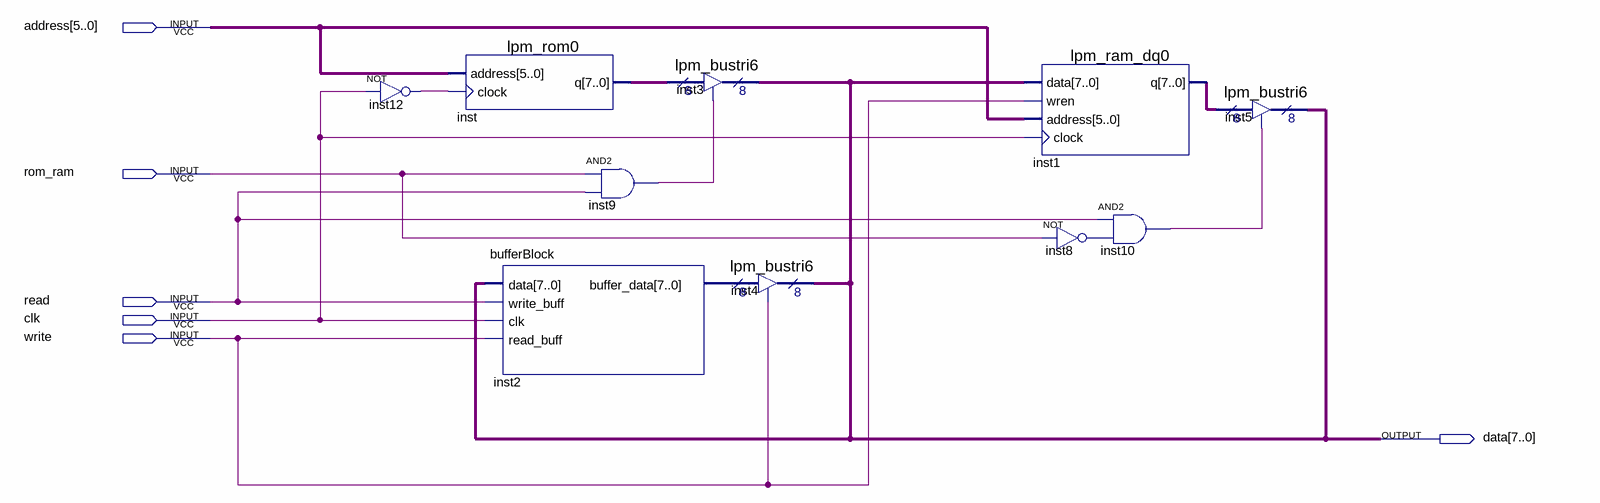
[diagram p0: schematic sheet]
// Quartus schematic mainBlock.bdf as structural Verilog: 10 symbols, 6 pins
module mainBlock (
  input  [5:0] address,
  input  rom_ram,
  input  read,
  input  clk,
  input  write,
  output [7:0] data
);

  wire inst8_out, inst9_out, inst10_out, inst12_out;
  wire [7:0] inst1_q, inst2_buffer_data, inst_q;

  not inst12 (inst12_out, clk);
  lpm_rom0 inst (.address(address), .clock(inst12_out), .q(inst_q));
  bufferBlock inst2 (.data(data), .write_buff(read), .clk(clk), .read_buff(write), .buffer_data(inst2_buffer_data));
  and inst9 (inst9_out, rom_ram, read);
  lpm_bustri6 inst3 (.enabledt(inst9_out), .data(inst_q), .tridata(data));
  lpm_bustri6 inst4 (.enabledt(write), .data(inst2_buffer_data), .tridata(data));
  lpm_ram_dq0 inst1 (.data(data), .wren(write), .address(address), .clock(clk), .q(inst1_q));
  and inst10 (inst10_out, read, inst8_out);
  not inst8 (inst8_out, rom_ram);
  lpm_bustri6 inst5 (.enabledt(inst10_out), .data(inst1_q), .tridata(data));
endmodule
